# Altium schematic sheet CONN_PWR_TOP.SchDoc
size A; SheetNumber: 1; SheetTotal: 1
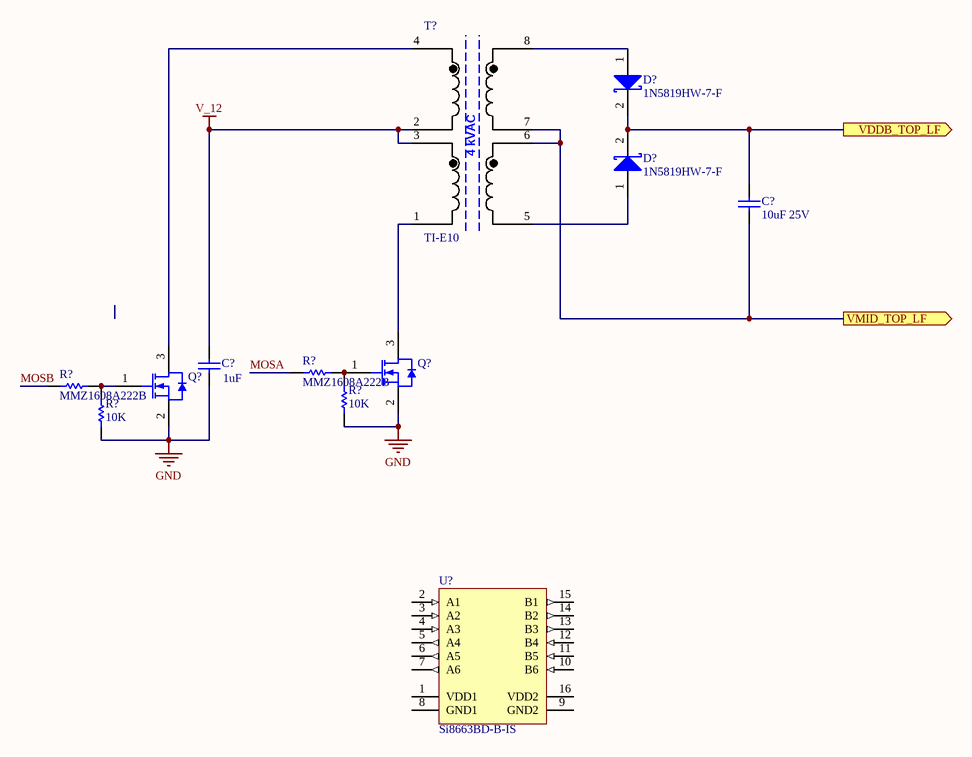
[diagram p0: CONN_PWR_TOP.SchDoc]

## Parts
(Parts that share a designator on the sheet are numbered #1, #2 ... from top to bottom, then left to right.)
C?#1  10uF 25V  [CAPC3216X229X50LL20T25]
C?#2  Capacitance: 1uF  [CAPC3216X180X50ML20T25]  (hidden comment: C1206C105K3RACTU)
D?#1  1N5819HW-7-F  [DIOD-SOD-123-2_V]
D?#2  1N5819HW-7-F  [DIOD-SOD-123-2_V]
Q?#1  2N7002K  [ONSC-SOT-23-3-318-08_V]  (value not drawn)
Q?#2  2N7002K  [ONSC-SOT-23-3-318-08_V]  (value not drawn)
R?#1  MMZ1608A222B  [RESC2013X70X40LL20T20]
R?#2  MMZ1608A222B  [RESC2013X70X40LL20T20]
R?#3  10K  [RESC1608X55X30NL20T10]
R?#4  10K  [RESC1608X55X30NL20T10]
T?  TI-E10  [EE10-K-V-8P-SS-WZ2579]
U?  Si8663BD-B-IS  [SLAB-SOIC-16-WB_N]

## Ports
VDDB_TOP_LF (out), VMID_TOP_LF (out)

## Nets
GND: C?#2.1 Q?#1.2(S) Q?#2.2(S) R?#3.1 R?#4.1
V_12: C?#2.2 T?.2 T?.3
MOSA: R?#1.1
MOSB: R?#2.1
VDDB_TOP_LF: C?#1.2 D?#1.2(K) D?#2.2(K) ; port VDDB_TOP_LF
VMID_TOP_LF: C?#1.1 T?.6 T?.7 ; port VMID_TOP_LF
NetD?#1_1: D?#1.1(A) T?.8
NetD?#2_1: D?#2.1(A) T?.5
NetQ?#1_1: Q?#1.1(G) R?#1.2 R?#3.2
NetQ?#1_3: Q?#1.3(D) T?.1
NetQ?#2_1: Q?#2.1(G) R?#2.2 R?#4.2
NetQ?#2_3: Q?#2.3(D) T?.4

Not connected (* = marked no-connect by the designer): U? 1(VDD1) 2(A1) 3(A2) 4(A3) 5(A4) 6(A5) 7(A6) 8(GND1) 9(GND2) 10(B6) 11(B5) 12(B4) 13(B3) 14(B2) 15(B1) 16(VDD2)

## Notes on the sheet
- (in symbol TI-E10) 4 kVAC

## Library data of the parts
C?#1 = CMP-2000-05863-1: Chip Capacitor, 10 uF, +/- 10%, 25 V, -55 to 85 degC, 1206 (3216 Metric), RoHS, Tape and Reel; Manufacturer: AVX; Dielectric: X5R; Capacitance: 10µF; Mounting Technology: SurfaceMount; Package Reference: 1206; Tolerance (%): ±10%; Manufacturer URL: http://www.avx.com/; Rated Voltage: 25V; Datasheet URL: http://datasheets.avx.com/cx5r.pdf; Package Description: 2-Pin Surface Mount Device, Body 3.2 x 1.6 mm; Datasheet Version: 05/2016; Case Size/Dimension: 1206
C?#2 = CMP-2000-04991-1: Chip Capacitor, 1 uF, +/- 10%, 25 V, -55 to 125 degC, 1206 (3216 Metric), RoHS, Tape and Reel; Manufacturer: Kemet; Temperature Coefficient / Code: +/-15%; Dielectric: X7R; Voltage Rating DC: 25V; Capacitance - nF: 1000nF; Class: Class1; Case Length: 3.2mm; Type: SMDMLCCX7R6.3-250VDCCommericalGrade; Case Width: 1.6mm; Product: GeneralTypeMLCCs; Datasheet URL: https://ciiva.com/datasheet-click-18194173?src=ciiva&sig=6daff8c4; Operating Temperature Range: -55Cto+125C; Series: C1206C; RoHS: Details; Product Category: MultilayerCeramicCapacitorsMLCC-SMD/SMT; Manufacturer URL: http://www.kemet.com/; Minimum Operating Temperature: -55C; Dimensions: 1.6mmWx3.2mmLx1.6mmH; Termination Style: SMD/SMT; Brand: Kemet; Packaging: Reel; Package / Case: 1206(3216metric); Case Code - mm: 3216; Datasheet Version: Jul-14; Factory Pack Quantity: 2000; Package Description: 2-Pin Surface Mount Device, Body 3.2 x 1.6 mm; Tolerance: 10%; Package Reference: 1206; Case Height: 1.6mm; Case Code - in: 1206; Maximum Operating Temperature: +125C; Voltage Rating: 25V
D?#1 D?#2 = CMP-0303-00003-1: 1.0 A Surface Mount Schottky Barrier Rectifier, 40 V, -65 to 125 degC, 2-Pin SOD-123 Package, RoHS, Tape and Reel; Manufacturer: Diodes Inc; @ VR (V): 40; @ Terminal Temperature TT (degC): 90; Maximum Average Rectified Current IO (A): 1; Total Capacitance CT (pF): 50; Peak Forward Surge Current IFSM (A): 25; Forward Voltage Drop VF (V): 0.45; VR (RMS) (V): 28; RoHS: TRUE; PartNumber: 1N5819HW-7-F; ComponentLink2URL: http://www.diodes.com/datasheets/ds30217.pdf; PackageDescription: 2-Pin SOD-123, Body 2.7 x 1.55 mm, Pitch 3.7 mm; @ IF (A): 1; Operating and Storage Temperature Range: -65 to 125 degC; ComponentLink1Description: Manufacturer URL; ComponentLink2Description: Datasheet; ComponentLink1URL: http://www.diodes.com/; Mounting Technology: Surface Mount; DatasheetVersion: Rev. 15-2; PackageReference: SOD-123-2; Maximum Reverse Current IR (uA): 50; Peak Repetitive Reverse Voltage VRRM (V): 40; Packing: Tape and Reel
Q?#1 Q?#2 = CMP-1058-00743-1: Power MOSFET, 30 V, 2.5 A, Single N-Channel, 3-Pin SOT-23, Pb-Free, Tape and Reel; Manufacturer: Diodes; Manufacturer Part Number: 2N7002K-7; VGS(th) Max (V): 3; VGS Max (V): 20; Channel Polarity: N Channel; ID Max (A): 2.5; Qrr Typ (nC): 4; V(BR)DSS Min (V): 30; Max Power Dissipation: 420mW; Power Dissipation: 730mW; Drain to Source Voltage (Vdss): 30V; Continuous Drain Current (ID): 2A; Rds On Max: 110mR; Input Capacitance: 135pF; Turn-On Delay Time: 5.8ns; Gate to Source Voltage (Vgs): 20V; Drain to Source Resistance: 140mR; Number of Elements: 1; Turn-Off Delay Time: 14ns; PackageReference: SOT-23-3-318-08; RoHS: Pb-Free; ComponentLink3Description: Package Specification; PackageVersion: Rev. AP, 11/2009; PartNumber: 2N7002K; ComponentLink1URL: http://www.onsemi.com/; ComponentLink2URL: http://www.onsemi.cn/pub_link/Collateral/NTR4503N-D.PDF; ComponentLink1Description: Manufacturer URL; Packing: Tape and Reel; ComponentLink2Description: Datasheet; Package Type: SOT-23-3; Configuration: Single; Mounting Technology: Surface Mount; ComponentLink3URL: http://www.onsemi.cn/pub_link/Collateral/318-08.PDF; PackageDescription: 3-Pin Small Outline Transistor, Body 2.92 x 1.3 mm, Pitch 0.95 mm; DatasheetVersion: Rev. 6; Supplier 1: Digi-Key; Supplier Part Number 1: NVTR4503NT1GOSCT-ND; Category: MOSFETs; Stock 1: 5720; Pricing 1: 1=0.38000, 10=0.28500, 100=0.13540, 500=0.11048, 1000=0.08197 (USD); Case/Package: SOT-23-3; Number of Pins: 3; Min Operating Temperature: -55°C; Max Operating Temperature: 150°C; Packaging: Tape and Reel; Package Quantity: 3000; Element Configuration: Single; Length: 3.04mm; Height: 1.01mm; Width: 1.4mm; Radiation Hardening: No; Lead Free: Lead Free; ComponentLink4URL: https://datasheet.ciiva.com/11168/ntr4503n-d-11168241.pdf?src-supplier=Avnet; ComponentLink4Description: https://datasheet.ciiva.com/11168/ntr4503n-d-11168241.pdf?src-supplier=Avnet; ComponentLink5URL: https://datasheet.ciiva.com/6368/ntr4503n-d-6368436.pdf?src-supplier=Digi-Key; ComponentLink5Description: https://datasheet.ciiva.com/6368/ntr4503n-d-6368436.pdf?src-supplier=Digi-Key; ComponentLink6URL: https://datasheet.ciiva.com/26019/ncv7425-d-26019945.pdf?src-supplier=Avnet+Europe; ComponentLink6Description: https://datasheet.ciiva.com/26019/ncv7425-d-26019945.pdf?src-supplier=Avnet+Europe; ComponentLink7URL: https://datasheet.ciiva.com/30480/0900766b81206070-30480044.pdf?src-supplier=RSComponents; ComponentLink7Description: https://datasheet.ciiva.com/30480/0900766b81206070-30480044.pdf?src-supplier=RSComponents; ComponentLink8URL: https://datasheet.ciiva.com/6368/ntr4503n-d-6368438.pdf?src-supplier=Digi-Key; ComponentLink8Description: https://datasheet.ciiva.com/6368/ntr4503n-d-6368438.pdf?src-supplier=Digi-Key; ComponentLink9URL: https://datasheet.ciiva.com/6368/ntr4503n-d-6368441.pdf?src-supplier=Digi-Key; ComponentLink9Description: https://datasheet.ciiva.com/6368/ntr4503n-d-6368441.pdf?src-supplier=Digi-Key
R?#1 R?#2 = CMP-1665-00033-1: Chip Resistor, 4.7 Ohm, +/- 1%, 125 mW, -55 to 125 degC, 0805 (2012 Metric), RoHS, Tape and Reel; PartNumber: ERJ-6RQF4R7V; Manufacturer: Panasonic; Power Rating: 125 mW; Case\/Package: 0805; Resistance: 4.7 Ohm; Temperature Coefficient: 200ppm/°C; Max Power Dissipation: 125mW; Mount: Surface Mount; Length: 0.079 inch; Tolerance: 1%; REACH SVHC: No SVHC; PackageDescription: 2-Pin Surface Mount Device, Body 2 x 1.5 mm; ComponentLink1URL: http://www.panasonic.com/; Width: 0.049 inch; Min Operating Temperature: -55 degC; Height: 0.028 inch; Case Code (Metric): 2012; Mounting Technology: Surface Mount; Pins: 2; Max Operating Temperature: 125 degC; Packaging: Tape and Reel; ComponentLink2URL: http://industrial.panasonic.com/cdbs/www-data/pdf/RDA0000/AOA0000C86.pdf; RoHSCompliant: true; ComponentLink2Description: Datasheet; PackageReference: 0805; Package Quantity: 5000; ComponentLink1Description: Manufacturer URL; Radiation Hardening: No; Case Code (Imperial): 0805; DatasheetVersion: 04/2015; Supplier 1: Digi-Key; Supplier Part Number 1: P4.7DCT-ND; Manufacturer Part Number: ERJ-6RQF4R7V; RoHS: Yes; Category: Chip SMD Resistors; Stock 1: 7470; Pricing 1: 1=0.37000, 10=0.31100, 25=0.22640, 50=0.16420, 100=0.12170, 250=0.09340, 500=0.07358, 1000=0.05094 (USD); Case/Package: 0805; Number of Pins: 2; Contact Plating: Tin; Composition: Thick Film; Number of Terminations: 2; Termination: SMD/SMT; Military Standard: Not; Depth: 1.25mm; Lead Free: Lead Free; ComponentLink3URL: https://datasheet.ciiva.com/11818/0900766b80eefa12-11818492.pdf?src-supplier=RSComponents; ComponentLink3Description: https://datasheet.ciiva.com/11818/0900766b80eefa12-11818492.pdf?src-supplier=RSComponents; ComponentLink4URL: https://datasheet.ciiva.com/25711/391509-25711737.pdf?src-supplier=Farnell; ComponentLink4Description: https://datasheet.ciiva.com/25711/391509-25711737.pdf?src-supplier=Farnell; ComponentLink5URL: https://datasheet.ciiva.com/17213/aoa0000ce3-17213115.pdf?src-supplier=Avnet+Europe; ComponentLink5Description: https://datasheet.ciiva.com/17213/aoa0000ce3-17213115.pdf?src-supplier=Avnet+Europe; ComponentLink6URL: https://datasheet.ciiva.com/22746/391509-22746507.pdf?src-supplier=Element14; ComponentLink6Description: https://datasheet.ciiva.com/22746/391509-22746507.pdf?src-supplier=Element14; ComponentLink7URL: https://datasheet.ciiva.com/9195/aoa0000ce3-9195709.pdf?src-supplier=Avnet; ComponentLink7Description: https://datasheet.ciiva.com/9195/aoa0000ce3-9195709.pdf?src-supplier=Avnet; ComponentLink8URL: https://datasheet.ciiva.com/16761/70068852-16761070.pdf?src-supplier=Allied+Electronics; ComponentLink8Description: https://datasheet.ciiva.com/16761/70068852-16761070.pdf?src-supplier=Allied+Electronics; ComponentLink9URL: https://datasheet.ciiva.com/22730/391509-22730382.pdf?src-supplier=Element14; ComponentLink9Description: https://datasheet.ciiva.com/22730/391509-22730382.pdf?src-supplier=Element14; ComponentLink10URL: https://datasheet.ciiva.com/24026/aoa0000ce3-72189-24026846.pdf?src-supplier=Mouser; ComponentLink10Description: https://datasheet.ciiva.com/24026/aoa0000ce3-72189-24026846.pdf?src-supplier=Mouser; ComponentLink11URL: https://datasheet.ciiva.com/30074/6aoa0000ce3-30074670.pdf?src-supplier=Onlinecomponents.com; ComponentLink11Description: https://datasheet.ciiva.com/30074/6aoa0000ce3-30074670.pdf?src-supplier=Onlinecomponents.com
R?#3 R?#4 = CMP-2000-01851-1: RK73B1JTTD103J; Manufacturer: KOA Speer; Resistance: 10kR; Tolerance: 5%; Power Rating: 100mW; Temperature Coefficient: 200ppm/°C; Voltage Rating: 50V; Part Number: RK73B1JTTD103J; Supplier 1: Digi-Key; Supplier Part Number 1: 2019-RK73B1JTTD103JCT-ND; Manufacturer Part Number: RK73B1JTTD103J; Stock 1: 652898; Pricing 1: 1=0,10000, 10=0,01500, 100=0,00610, 1000=0,00275, 2500=0,00239 (USD); RoHS: Yes; Case/Package: 0603; Number of Pins: 2; Case Code (Imperial): 0603; Case Code (Metric): 1608; Min Operating Temperature: -55°C; Max Operating Temperature: 155°C; Packaging: Tape and Reel; Composition: Thick Film; Termination: SMD/SMT; Military Standard: Not; Package Quantity: 5000; Voltage Rating (DC): 50V; Length: 1.6mm; Height: 0.45mm; Depth: 0.8mm; Width: 0.8mm; Lead Free: Lead Free; ComponentLink1URL: https://datasheet.ciiva.com/34302/1877832-34302947.pdf?src-supplier=Jameco; ComponentLink1Description: https://datasheet.ciiva.com/34302/1877832-34302947.pdf?src-supplier=Jameco; ComponentLink2URL: https://datasheet.ciiva.com/5554/rk73b-5554408.pdf?src-supplier=Mouser; ComponentLink2Description: https://datasheet.ciiva.com/5554/rk73b-5554408.pdf?src-supplier=Mouser; ComponentLink3URL: https://datasheet.ciiva.com/7773/548635-7773278.pdf?src-supplier=Element14; ComponentLink3Description: https://datasheet.ciiva.com/7773/548635-7773278.pdf?src-supplier=Element14
T? = TI-E10: Push Pull
U? = CMP-0512-00250-1: Low Power Six-Channel Digital Isolator, 150 Mbps, 5 kVRMS Isolation Rating, -40 to 125 degC, 16-pin SOIC; Manufacturer: Silicon Labs; Maximum Data Rate (Mbps): 150; Channel Type: Unidirectional; Maximum Propagation Delay (ns): 13; Sub-Family: Isolators; AEC-Q100: FALSE; Isolation Rating (kV): 5; ComponentLink3Description: Package Specification; PartNumber: Si8663BD-B-IS; PackageDescription: 16-Pin Wide Body Plastic Small Outline, Body 10.3 x 7.5 mm, Pitch 1.27 mm; PackageReference: SOIC-16-WB; DatasheetVersion: Rev. 1.4; Mounting Technology: Surface Mount; Code_JEDEC: MS-013; ComponentLink2Description: Datasheet; Enable Control: FALSE; ComponentLink3URL: https://www.silabs.com/Support%20Documents/TechnicalDocs/Si823x.pdf; ComponentLink1URL: http://www.silabs.com/; ComponentLink1Description: Manufacturer URL; ComponentLink2URL: http://www.silabs.com/Support%20Documents/TechnicalDocs/Si866x.pdf; 10kV surge: FALSE